# EAGLE design irs-lsm303d-v2 (EAGLE 7.6.0)
CNAME: IRS sensor (RFM69HW); CREVISION: 1; DESIGNER: Dariusz Mazur
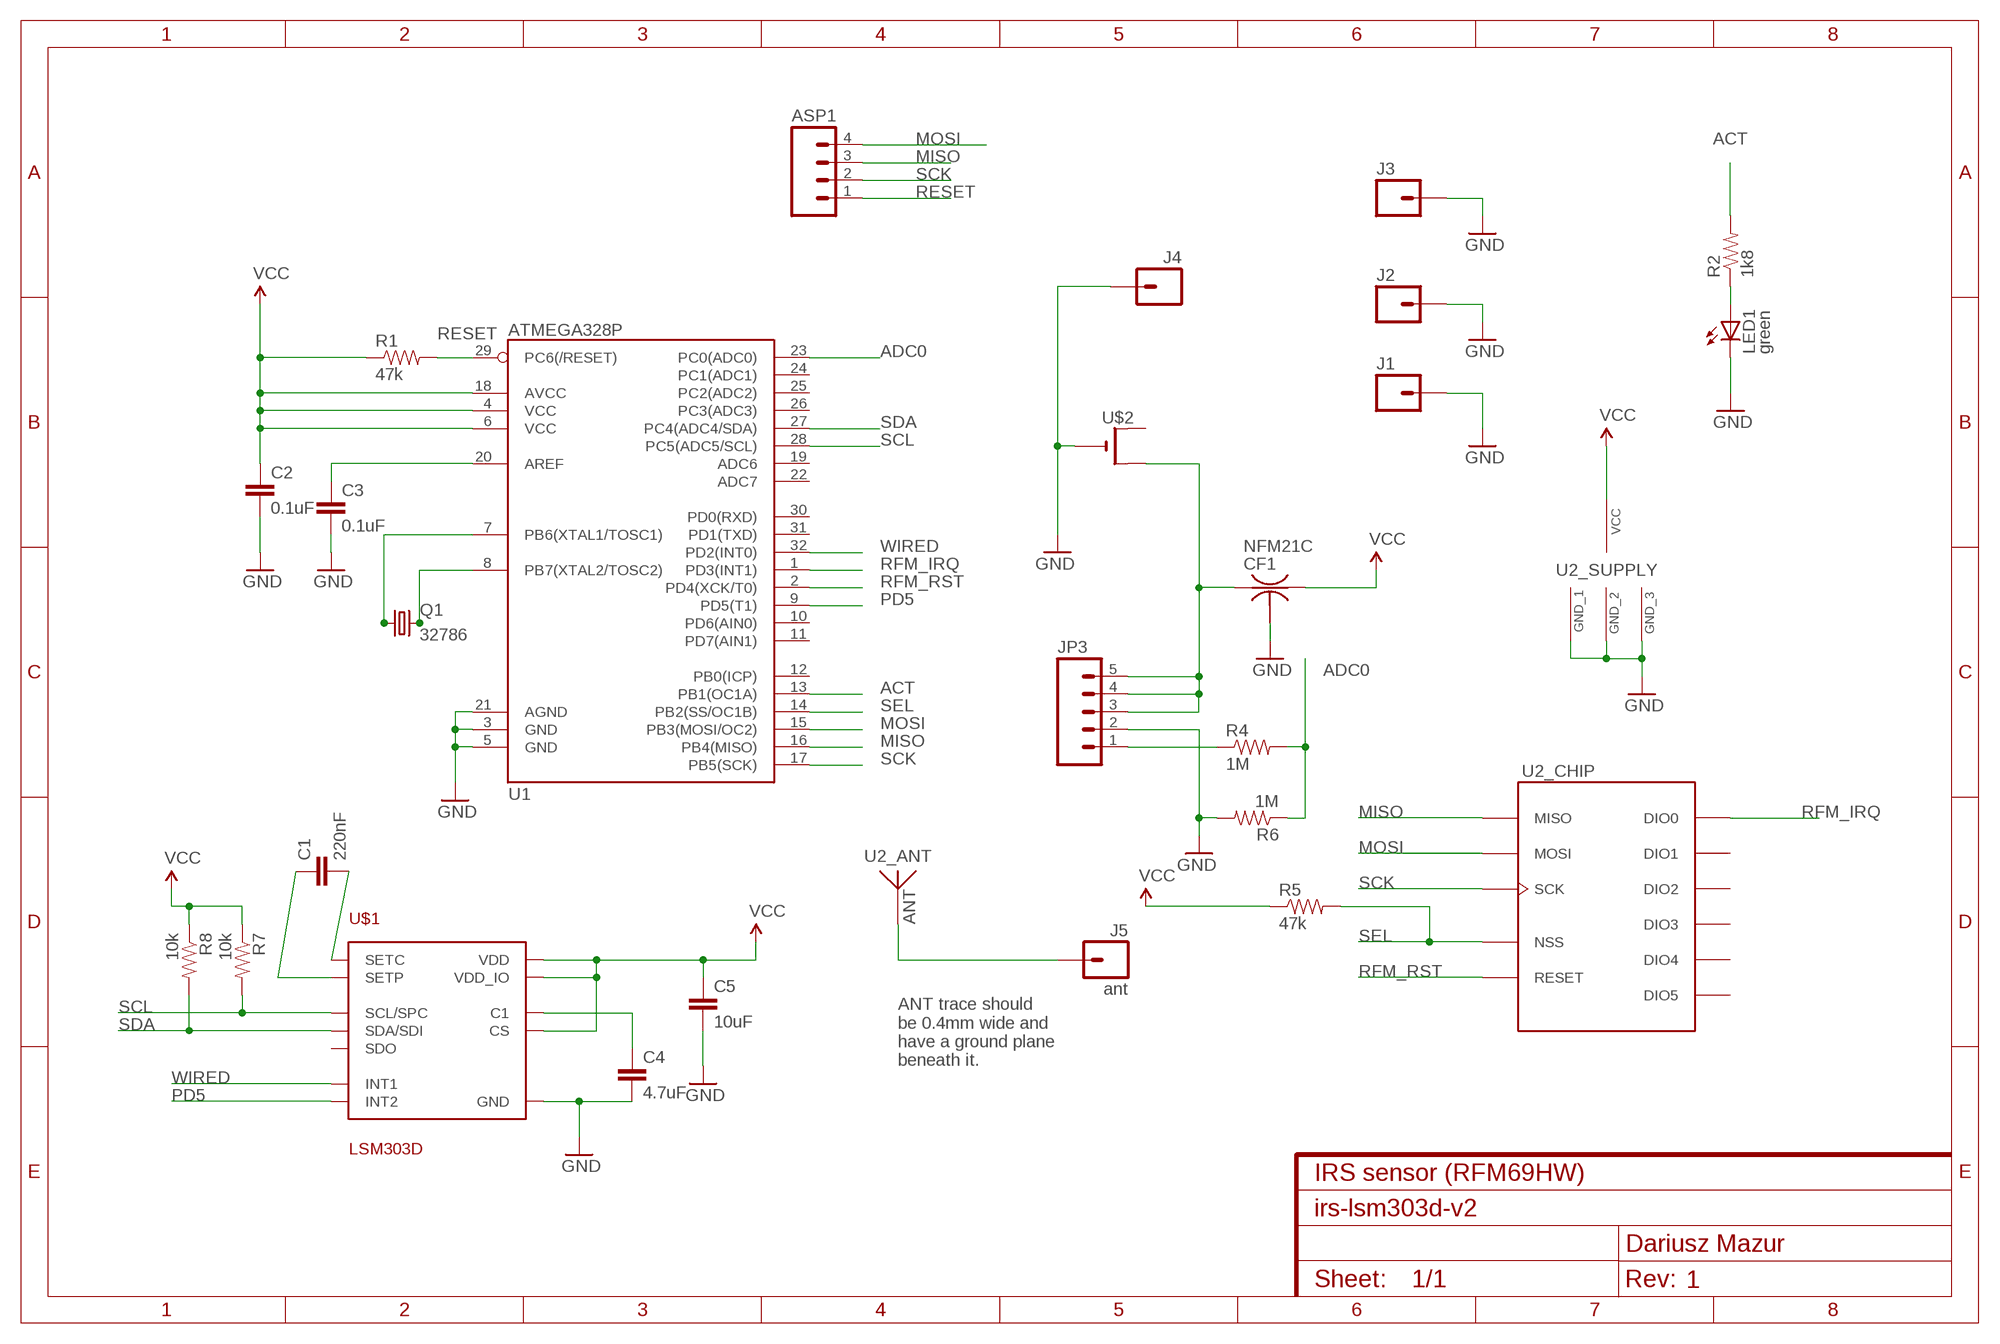
[diagram p0: schematic, sheet 1]

## Parts
ASP1  M04NO_SILK_ALL_ROUND  [1X04_NO_SILK_ALL_ROUND]
C1  220nF  C-EUC0603K  [C0603K]
C2  0.1uF  C-EUC0603K  [C0603K]
C3  0.1uF  0.1UF-25V(+80/-20%)(0603)  [0603-CAP]
C4  4.7uF  C-EUC0603K  [C0603K]
C5  10uF  10UF10V10%(0805)  [0805-CAP]
CF1  NFM21C  [NFM21C]
J1  M01PTH_NO_SILK_YES_STOP  [1X01_NO_SILK]
J2  M01PTH_NO_SILK_YES_STOP  [1X01_NO_SILK]
J3  M01PTH_NO_SILK_YES_STOP  [1X01_NO_SILK]
J4  M01SNAP-FEMALE  [SNAP-FEMALE]
J5  ant  M01PTH_NO_SILK_YES_STOP  [1X01_NO_SILK]
JP3  M05NO_SILK  [1X05_NO_SILK]
LED1  green  LED0603  [LED-0603]
Q1  32786  MC-306  [MC-306]
R1  47k  RESISTOR0603-RES  [0603-RES]
R2  1k8  RESISTOR0603-RES  [0603-RES]
R4  1M  RESISTOR0603-RES  [0603-RES]
R5  47k  RESISTOR0603-RES  [0603-RES]
R6  1M  RESISTOR0603-RES  [0603-RES]
R7  10k  RESISTOR0603-RES  [0603-RES]
R8  10k  RESISTOR0603-RES  [0603-RES]
U1  ATMEGA328P  ATMEGA328_SMT  [TQFP32-08]
U2  RFM69HCW-S2  [HOPE-RF-16]
U$1  LSM303D  [LGA16-3MM]
U$2  CR2032THM  [CR2032-THRU]

## Nets
ACT: R2.2 U1.13(PB1(OC1A))
ADC0: R4.2 R6.1 U1.23(PC0(ADC0))
GND: C2.2 C3.2 C4.2 C5.2 CF1.2@1 J1.1 J2.1 J3.1 J4.1 JP3.2 LED1.C R6.2 U1.3(GND) U1.5(GND) U1.21(AGND) U2.GND1(_SUPPLY:GND_1) U2.GND2(_SUPPLY:GND_2) U2.GND3(_SUPPLY:GND_3) U$1.5(GND) U$1.10(GND) U$1.12(GND) U$1.13(GND) U$1.16(GND) U$2.-
MISO: ASP1.3 U1.16(PB4(MISO)) U2.MISO(_CHIP:MISO)
MOSI: ASP1.4 U1.15(PB3(MOSI/OC2)) U2.MOSI(_CHIP:MOSI)
N$1: LED1.A R2.1
N$2: JP3.1 R4.1
N$3: J5.1 U2.ANT(_ANT:ANT)
N$4: C3.1 U1.20(AREF)
N$5: Q1.1 U1.7(PB6(XTAL1/TOSC1))
N$6: Q1.4 U1.8(PB7(XTAL2/TOSC2))
N$7: CF1.1 JP3.3 JP3.4 JP3.5 U$2.+2(+1)
N$12: C1.1 U$1.3(SETP)
N$13: C1.2 U$1.2(SETC)
N$14: C4.1 U$1.15(C1)
PD5: U1.9(PD5(T1)) U$1.9(INT2)
RESET: ASP1.1 R1.2 U1.29(PC6(/RESET))
RFM_IRQ: U1.1(PD3(INT1)) U2.DIO0(_CHIP:DIO0)
RFM_RST: U1.2(PD4(XCK/T0)) U2.RESET(_CHIP:RESET)
SCK: ASP1.2 U1.17(PB5(SCK)) U2.SCK(_CHIP:SCK)
SCL: R7.2 U1.28(PC5(ADC5/SCL)) U$1.4(SCL/SPC)
SDA: R8.2 U1.27(PC4(ADC4/SDA)) U$1.6(SDA/SDI)
SEL: R5.2 U1.14(PB2(SS/OC1B)) U2.NSS(_CHIP:NSS)
VCC: C2.1 C5.1 CF1.3 R1.1 R5.1 R7.1 R8.1 U1.4(VCC) U1.6(VCC) U1.18(AVCC) U2.3.3V(_SUPPLY:VCC) U$1.1(VDD_IO) U$1.8(CS) U$1.14(VDD)
WIRED: U1.32(PD2(INT0)) U$1.11(INT1)
Unconnected: CF1.2@2 U1.10(PD6(AIN0)) U1.11(PD7(AIN1)) U1.12(PB0(ICP)) U1.19(ADC6) U1.22(ADC7) U1.24(PC1(ADC1)) U1.25(PC2(ADC2)) U1.26(PC3(ADC3)) U1.30(PD0(RXD)) U1.31(PD1(TXD)) U2.DIO1(_CHIP:DIO1) U2.DIO2(_CHIP:DIO2) U2.DIO3(_CHIP:DIO3) U2.DIO4(_CHIP:DIO4) U2.DIO5(_CHIP:DIO5) U$1.7(SDO) U$2.+1(+)

## Notes on the sheet
- ANT trace should
  be 0.4mm wide and
  have a ground plane
  beneath it.

## Library data of the parts
ASP1 = SparkFun-Connectors:M04: Header 4 Standard 4-pin 0.1" header. Use with straight break away headers (SKU : PRT-00116), right angle break away headers (PRT-00553), swiss pins (PRT-00743), machine pins (PRT-00117), and female headers (PRT-00115). Molex polarized connector foot print use with SKU : PRT-08231 with associated crimp pins and housings. 1MM SMD Version SKU: PRT-10208; PROD_ID: CONN-09696
C1 C2 C4 = resistor:C-EU: CAPACITOR, European symbol
C3 = SparkFun-Capacitors:0.1UF-25V(+80/-20%)(0603): CAP-00810 Ceramic Standard decoupling cap; PROD_ID: CAP-00810
C5 = SparkFun-Capacitors:10UF10V10%(0805): CAP-11330; PROD_ID: CAP-11330
CF1 = murata-filter:NFM: EMIFIL(R) (Capacitor type) Single Circuit Type for Signal Lines Source: http://search.murata.co.jp/Ceramy/image/img/PDF/ENG/L0111S0109NFM3DC.pdf; MPN: NFM21CC102R1H3D; OC_FARNELL: 1828795; OC_NEWARK: 84R0165
J1-J5 = SparkFun-Connectors:M01: Header 1 Standard 1-pin 0.1" header. Use with straight break away headers (SKU : PRT-00116), right angle break away headers (PRT-00553), swiss pins (PRT-00743), machine pins (PRT-00117), and female headers (PRT-00115). SMTSO-256-ET is a "flush mount" nut for a 4-40 screw. The older package used to be too tight, and did not allow it to sit properly thru the drill hit. The latest (0.165DIA) fits nice and snug.
JP3 = SparkFun-Connectors:M05: Header 5 Standard 5-pin 0.1" header. Use with straight break away headers (SKU : PRT-00116), right angle break away headers (PRT-00553), swiss pins (PRT-00743), machine pins (PRT-00117), and female headers (PRT-00115). Molex polarized connector foot print use with SKU : PRT-08230 with associated crimp pins and housings.
LED1 = SparkFun-LED:LED: LEDs Standard schematic elements and footprints for 5mm, 3mm, 1206, and 0603 sized LEDs. 5mm - Spark Fun Electronics SKU : COM-00529 (and others)
Q1 = crystal:MC-306: kHz RANGE CRYSTAL UNIT SMD Source: MC-306_405_406_E07X.PDF Homepage <http://www.epsontoyocom.co.jp>; MPN: MC-306 60.0KHZ 100PPM ,12.5PF; OC_FARNELL: 1278040; OC_NEWARK: 31M5576
R1 R2 R4-R8 = SparkFun-Passives:RESISTOR: Resistor Basic schematic elements and footprints for 0603, 1206, and PTH resistors.
U1 = SparkFun-DigitalIC:ATMEGA328_SMT: 32-Pin Atmega328 part Commonly used on Arduino compatible boards Available in QFP and QFN packages TQFP is IC-09069 QFN is non-stock; PROD_ID: IC-09069
U2 = icmi-custom-parts:RFM69HCW: HopeRF RFM69HCW ISM Transceiver Module The RFM69HCW <http://www.hoperf.com/rf/fsk_module/RFM69HCW.htm> is a transceiver module capable of operation over a wide frequency range, including the 315,433,868 and 915MHz license-free ISM (Industry Scientific and Medical) frequency bands. All major RF communication parameters are programmable and most of them can be dynamically set. The RFM69HCW offers the unique advantage of programmable narrow-band and wide- band communication modes. The RFM69HCW is optimized for low power consumption while offering high RF output power and channelized operation. Compliance ETSI and FCC regulations. In order to better use RFM69HCW modules, this specification also involves a large number of the parameters and functions of its core chip RF69H's,including those IC pins which are not leaded out. All of these can help customers gain a better understanding of the performance of RFM69HCW modules, and enhance the application skills.
U$1 = pimoroni-ics:LSM303D
U$2 = adafruit:CR2032

## Board
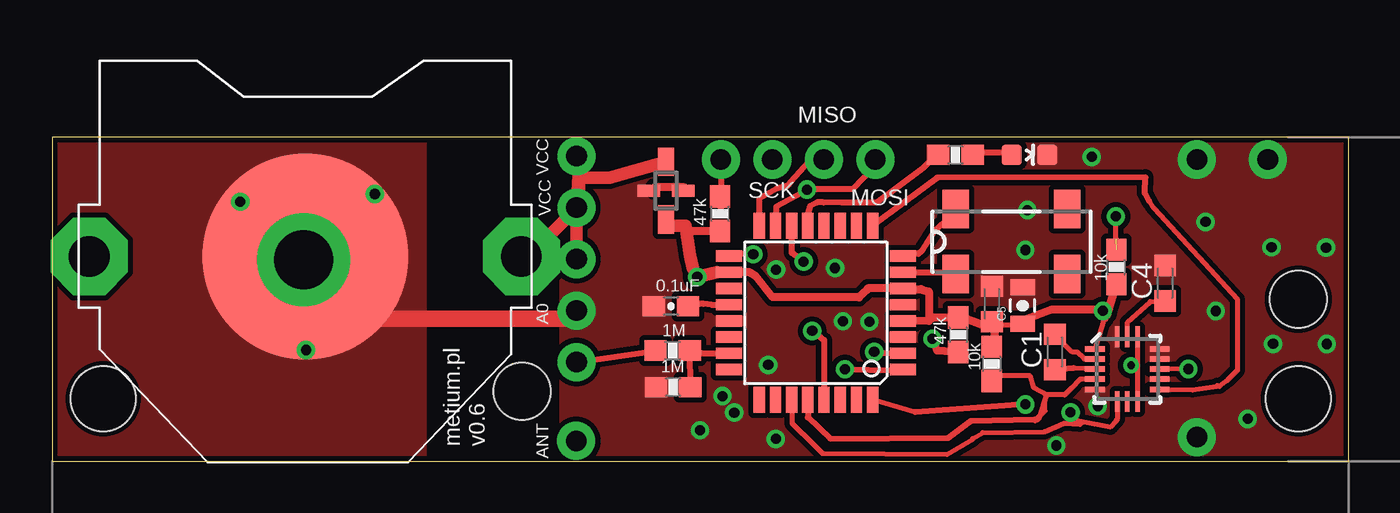
[diagram p1: board, top side]
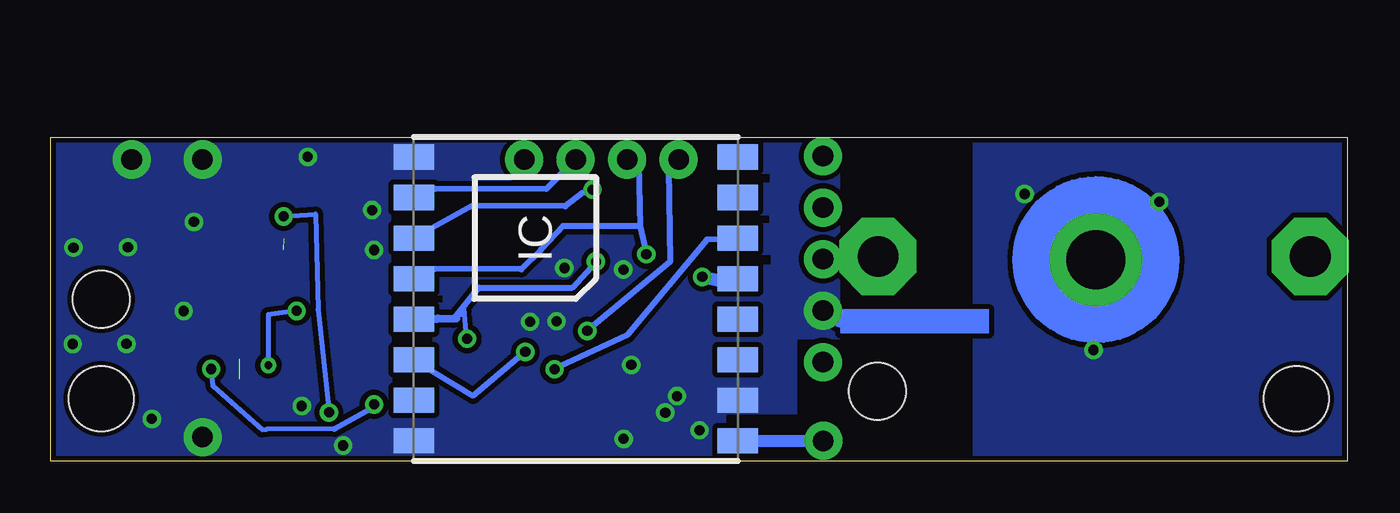
[diagram p2: board, bottom side, seen from below]

Size 64 x 16 mm. Coordinates in mm from the lower left corner, seen from the top.
Outline: 0,0 64,0 64,16 0,16 0,0
Copper layers (1*16): Top 0.035mm / dielectric 1.5mm / Bottom 0.035mm
Design rules "dirt_cheap_dirty_boards.v1 *": minimum track width 10mil, minimum drill 15mil, track to track 10mil, track to pad 14mil, pad to pad 12mil, via to via 12mil, smd to smd 0mil, copper to edge 10mil, drill to drill 12mil, minimum pad ring 12mil, minimum via ring 8mil, stop-mask expansion 2mil, vias tented up to drill 25mil, thermal gap 10mil
Holes 2.8 mm at 61.5,8 23.18,3.47
Holes 3.2 mm at 61.5,3.1 2.5,3.1
tRestrict: area 18.5,0 to 25,16
bRestrict: area 45.1,3.8 to 47.1,4.1; area 44.7,7.9 to 47.2,8.2; area 45.1,5.8 to 47.1,6.2; area 18.5,0 to 25,16; area 28.5,9.7 to 30.6,10.2; area 28.5,13.8 to 30.6,14.2; area 28.5,11.8 to 30.6,12.1; area 25,1.9 to 30.6,2.3; area 45,9.8 to 47.2,10.2; area 25,1.3 to 27.1,6; area 45,11.8 to 47.2,12.2

### Footprints (pad centres in the part's own frame; a part is rotated, then mirrored left to right if it is on the bottom)
1X04_NO_SILK_ALL_ROUND = drill 1.016 pad 1.88: 1 0,0; 2 2.54,0; 3 5.08,0; 4 7.62,0
C0603K = smd 1.05 x 1.08: 1 -0.875,0; 2 0.875,0
0603-CAP = smd 1.1 x 1: 1 -0.85,0; 2 0.85,0
0805-CAP = smd 0.8 x 1.2: 1 -0.9,0; 2 0.9,0
NFM21C = smd 1.4 x 0.8: 1 -1.425,0; 3 1.425,0 | smd 0.6 x 1.1: 2@1 0,-0.85; 2@2 0,0.85
1X01_NO_SILK = drill 1.016 pad 1.88: 1 0,0
SNAP-FEMALE = drill 2.921 pad 4.572: 1 0,0
1X05_NO_SILK = drill 1.016 pad 1.88: 1 0,0; 2 2.54,0; 3 5.08,0; 4 7.62,0; 5 10.16,0
LED-0603 = smd 1 x 1: A 0,-0.877; C 0,0.877
MC-306 = smd 1.3 x 1.9: 1 -2.75,-1.6; 2 2.75,-1.6; 3 2.75,1.6; 4 -2.75,1.6
0603-RES = smd 1.1 x 1: 1 -0.85,0; 2 0.85,0
TQFP32-08 = smd 1.27 x 0.559: 1 -4.293,2.8; 2 -4.293,2; 3 -4.293,1.2; 4 -4.293,0.4; 5 -4.293,-0.4; 6 -4.293,-1.2; 7 -4.293,-2; 8 -4.293,-2.8; 17 4.293,-2.8; 18 4.293,-2; 19 4.293,-1.2; 20 4.293,-0.4; 21 4.293,0.4; 22 4.293,1.2; 23 4.293,2; 24 4.293,2.8 | smd 0.559 x 1.27: 9 -2.8,-4.293; 10 -2,-4.293; 11 -1.2,-4.293; 12 -0.4,-4.293; 13 0.4,-4.293; 14 1.2,-4.293; 15 2,-4.293; 16 2.8,-4.293; 25 2.8,4.293; 26 2,4.293; 27 1.2,4.293; 28 0.4,4.293; 29 -0.4,4.293; 30 -1.2,4.293; 31 -2,4.293; 32 -2.8,4.293
HOPE-RF-16 = smd 1.25 x 2: 3.3V 1,-8; ANT -7,-8; DIO0 3,-8; DIO1 5,-8; DIO2 7,-8; DIO3 -3,-8; DIO4 -1,-8; DIO5 -5,8; GND1 7,8; GND2 -7,8; GND3 -5,-8; MISO 5,8; MOSI 3,8; NSS -1,8; RESET -3,8; SCK 1,8
LGA16-3MM = smd 1 x 0.25: 1 -1.6,1; 2 -1.6,0.5; 3 -1.6,0; 4 -1.6,-0.5; 5 -1.6,-1; 9 1.6,-1; 10 1.6,-0.5; 11 1.6,0; 12 1.6,0.5; 13 1.6,1 | smd 0.25 x 1: 6 -0.5,-1.6; 7 0,-1.6; 8 0.5,-1.6; 14 0.5,1.6; 15 0,1.6; 16 -0.5,1.6
CR2032-THRU = drill 2 pad 3.81 octagon: +1 -10.668,0; +2 10.668,0 | smd 10.16 x 10.16: - 0,0

### Placement (x,y rotation side)
ASP1  33,14.9 0 top
C1  49.48,5.4 90 top
C2  46.38,7.77 90 top
C3  30.53,7.66 180 top
C4  54.93,8.8 90 top
C5  47.9,7.7 90 top
CF1  30.3,13.37 270 top
J1  56.5,1.2 0 top
J2  60,14.9 90 top
J3  56.5,14.9 0 top
J4  12.4,9.96 0 bottom
J5  25.85,1.02 0 top
JP3  25.87,4.91 90 top
LED1  48.23,15.13 270 top
Q1  47.34,10.85 0 top
R1  32.96,12.22 90 top
R2  44.58,15.13 180 top
R4  30.62,5.47 0 top
R5  44.71,6.25 270 top
R6  30.64,3.67 180 top
R7  46.36,4.82 270 top
R8  52.52,9.59 90 top
U1  37.69,7.34 180 top
U2  38.08,8.02 90 bottom
U$1  53.06,4.56 0 top
U$2  12.48,10.12 0 top

### Tracks (layer width: path | path; a pad name or v marks a point on that pad's centre or on a via)
ACT
  Top 0.305: R2.2 43.5,15 43,14.5 40.68,12.78 38.97,12.77 38.06,12.79 37.75,12.79 37.4,12.6 37.29,12.24 U1.13
ADC0
  Top 0.305: 33.25,5.35 U1.23 32.06,5.34 arc-43 R4.2 R6.1
GND  (via drill 0.5, 0.5 pad 0.25)  (1 unrouted)
  Top 0.254: 42,7.75 U1.5 | U1.3 42.14,6.14
  Top 0.305: U1.21
  Top 0.406: 14.49,7.29 14.33,7.39 12.52,7.39 v12.52,5.5
  Top 0.813: JP3.2 25.93,7.45 25.93,7.04 14.14,7.04 14.14,8.46 14.49,7.29
  Bottom 0.254: 38.62,9.62 v38.63,9.55
  other vias: 33.08,3.22 35.71,1.12 33.66,2.41 31.97,1.54 60.26,5.8 60.18,10.57 59,2.1 51.31,15.03 57.43,7.42 39.02,6.92 48.13,12.41 40.33,6.89 48.03,10.43 35.34,4.76 49.56,0.79 56.93,11.82 62.91,5.79 35.72,9.47 15.92,13.2 9.28,12.82 62.87,10.55 51.6,2.74
  pour Bottom (rank 6, no thermals): 0,16 64,16 64,0 0,0
  pour Top (rank 6, no thermals): 0,16 64,16 64,0 0,0
MISO
  Top 0.305: U1.16 34.88,11.96 34.88,12.96 35.75,13.47 36.28,13.6 36.45,13.8 37.31,14.76 38,14.75 ASP1.3
  Bottom 0.305: U2.MISO 45.01,13.45 39.54,13.44 38.25,14.75 ASP1.3
MOSI  (via drill 0.5)
  Top 0.305: ASP1.4 40.5,14.5 39.52,13.45 37.27,13.45 v37.25,13.41 37,13.25 35.72,12.57 U1.15
  Bottom 0.305: U2.MOSI 43.18,12.61 38.6,12.58 37.75,13.25 v37.25,13.41
N$1
  Top 0.305: LED1.A 47.25,15.25 45.5,15.25 R2.1
N$2
  Top 0.305: JP3.1 R4.1
N$3
  Top 0.406: 25.85,1.09 J5.1
  Bottom 0.61: U2.ANT 25.85,1 J5.1
N$4
  Top 0.305: U1.20 32.52,7.74 arc27 C3.1
N$5
  Top 0.305: U1.7 44.34,9.34 Q1.1
N$6
  Top 0.305: U1.8 42,10.25 42.75,10.25 42.9,10.38 43.54,11.39 44.5,12.25 Q1.4
N$7
  Top 0.305: 26,14.5 26,14 JP3.4
  Top 0.406: 23.15,9.83 U$2.+2
  Top 0.61: CF1.1 27.5,14 26,14 26,12.5 | JP3.4 26,14.5 JP3.5 | 23.15,9.83 23.26,9.83 JP3.4 | JP3.3 JP3.4
N$11
  Top 0.406: 31.2,13.53 29.71,13.53 29.71,13.36
N$12
  Top 0.254: U$1.3 50.42,4.6
  Top 0.305: 50.42,4.6 C1.1
N$13
  Top 0.254: U$1.2 50.94,5.06 50.59,5.4 50.36,5.4 C1.2
N$14
  Top 0.254: U$1.15 53.08,6.86 54.19,7.88 54.21,7.89 C4.1
N$15
  Bottom 0.406: 23.52,6.97 23.52,7
  Bottom 0.813: 25.05,7.03 23.52,6.97
PD5
  Top 0.254: U$1.9 56.27,3.53 57.48,3.7 57.5,3.75 57.61,3.7 58,4 58.5,4.5 58.5,8 54.37,12.5 54.15,12.84
  Top 0.305: 54.15,12.84 53.93,13.26 53.96,14.01 43.68,14.01 U1.9
RESET  (via drill 0.5)
  Top 0.305: v37.51,6.44 38.1,5.99 38.1,3.54 U1.29 | ASP1.1 33,12.5 R1.2
  Bottom 0.305: v37.51,6.44 33.41,9.86 33.5,14.5 33,14.5 ASP1.1
RFM_IRQ  (via drill 0.5)
  Top 0.305: v39.13,4.55 41.5,4.5 U1.1
  Bottom 0.305: v39.13,4.55 39.2,4.55 35.52,6.25 31.61,10.95 U2.DIO0
RFM_RST  (via drill 0.5)
  Top 0.305: v40.57,5.41 41,5.36 41.74,5.32 42.08,5.34 U1.2
  Bottom 0.305: v40.57,5.41 43.15,3.25 U2.RESET
SCK  (via drill 0.5)
  Top 0.305: v34.6,10.23 33.5,10.25 U1.17
  Bottom 0.305: 34.9,11.62 34.98,14.7 35.5,14.75 ASP1.2 | 34.9,11.62 v34.6,10.23 | U2.SCK 45,9.5 40.77,9.48 39.77,10.48 39.8,10.45 38.71,11.62 34.9,11.62
SCL
  Top 0.254: U$1.4 50.7,4.05 50.7,4.03 50.3,3.62 50.3,3.6 49.98,3.29 49.04,3.29 49.09,3.3 | 49.09,3.3 48.45,3.64 48.27,4.23 46.27,4.23 R7.2 | 48.71,2.13 48.99,3 | 48.99,3 49.09,3.3 | 48.99,3 49,3 49,2.5 48.5,2 48.5,2.06
  Top 0.305: 48.62,2.06 48.5,2.06 45.33,1.99 44.22,1.16 38.4,1.13 37.29,2.18 U1.28
SDA  (via drill 0.5)  (1 unrouted)
  Top 0.254: U1.27 36.51,3.04 36.51,1.88 37.02,1.37 37.05,1.37 38.01,0.4 44.17,0.35 45.45,1.1 45.45,1.13 45.42,1.13 45.93,1.43 48.97,1.47 49.93,1.88 | 50.75,1.86 49.93,1.88 | 49.93,1.88 50.73,1.83 arc-24 v50.26,2.42 | 50.47,2.11 v50.26,2.42 | 52.5,11 v52.49,12.09 | v50.26,2.42 50.27,2.06 52.22,1.7 52.5,1.98 52.5,2.02 52.56,2.08 U$1.6
  Bottom 0.254: v52.49,12.09 50.92,12.2 50.8,7.49 v50.26,2.42
SEL  (via drill 0.5)
  Top 0.305: v37.08,9.86 36.51,10.29 36.51,11.5 36.5,11.5 U1.14
  Top 0.406: R5.2 43.69,5.46 v43.44,6.06
  Bottom 0.254: 43.96,7 44,7 44.08,7.06 | 43.86,7.33 43.75,7.25 43.62,7.56 43.48,6.12 43.5,6 v43.44,6.06 | 44.87,7.05 44.88,7.12 44.88,7.01
  Bottom 0.305: v37.08,9.86 38.24,8.58 42.86,8.58 43.86,7.33 44.08,7.06 44.12,7 44.88,7.01 U2.NSS
  Bottom 0.406: U2.NSS 45.5,6.94 | 45.76,7.04 44.87,7.05 43.97,7.06
VCC  (via drill 0.38, 0.5, 0.5 pad 0.61)
  Top 0.254: 46.25,6.62 C2.1 | 42.12,8.5 U1.6 | 43.38,7.11 43.45,7.08 | 41.98,6.92 U1.4 | 44.38,7.25 44.38,7.12 | R5.1 44.38,6.62 44.38,7 44.37,7.12 | 46.5,5.5 R7.1 | 46.5,6.5 C2.1 | C5.1 47.75,6.75 46.5,6.75 C2.1 | 48,6.75 C5.1 | 48.38,6.62 C5.1 | 51.5,7.5 52,7 | 52,7 51.87,6.91 U$1.1 | 48,7 C5.1 | 52,7 52.07,7.23 v51.86,7.43 | U$1.14 53.56,4.75 | 53.56,4.75 U$1.8 | v53.25,4.75 53.56,4.75
  Top 0.305: 40.24,8.53 40.24,8.5 40.25,8.5 40.25,8.54 | 41.75,6.95 U1.4 | 33.52,9.33 U1.18 | 31.62,9.5 v31.83,9.11 | 31.5,10 31.5,10.06
  Top 0.406: 33.52,9.33 34.43,9.33 34.67,9.18 35.55,8.11 39.82,8.09 40.25,8.5 | 32.81,9.34 U1.18 | U1.6 40.25,8.54 | 31.5,11.29 31.24,11.63 31.5,11.37 R1.1 | 46.25,6.62 44.91,7.12 44.38,7.12 44.37,7.12 43.38,7.11 | 43.27,6.94 43.26,8.38 42.88,8.5 42.12,8.5 | 43.27,6.94 43.45,7.08 | 43.27,6.94 41.98,6.92 | 30.3,11.63 CF1.3 | 46.5,6.5 46.5,5.5 | 51.5,7.5 49.36,7.5 48,7 | 52.07,7.23 R8.1
  Top 0.61: 32.81,9.34 v31.83,9.11 | 31.62,9.5 31.5,10.06 | 31.5,10 31.24,11.63 30.3,11.63
  Bottom 0.254: v53.25,4.75 53.25,7.25 v51.86,7.43
  Bottom 0.305: 30.32,8.89 U2.3.3V | 30.32,8.76 U2.3.3V | 29.37,9.21 U2.3.3V
  Bottom 0.61: 30.32,8.76 v31.83,9.11
WIRED  (via drill 0.5)
  Top 0.254: 42.58,2.43 U1.32 | v56.07,4.57 U$1.11
  Top 0.305: v48.03,2.82 42.58,2.43
  Bottom 0.254: v56.07,4.57 55.98,3.73 55.95,3.68 53.56,1.57 53.34,1.58 49.99,1.61 | 48.19,2.61 v48.03,2.82
  Bottom 0.305: 49.99,1.61 48.19,2.61
(copper drawn outside any net)
  shapes: Bottom area x1

### Text on the board
tPlace: MISO | VCC | SCK | MOSI | VCC | A0 | metium.pl / v0.6 | ANT
Document: RESET | VCC